# EAGLE design MotorBoard (EAGLE 8.3.2)
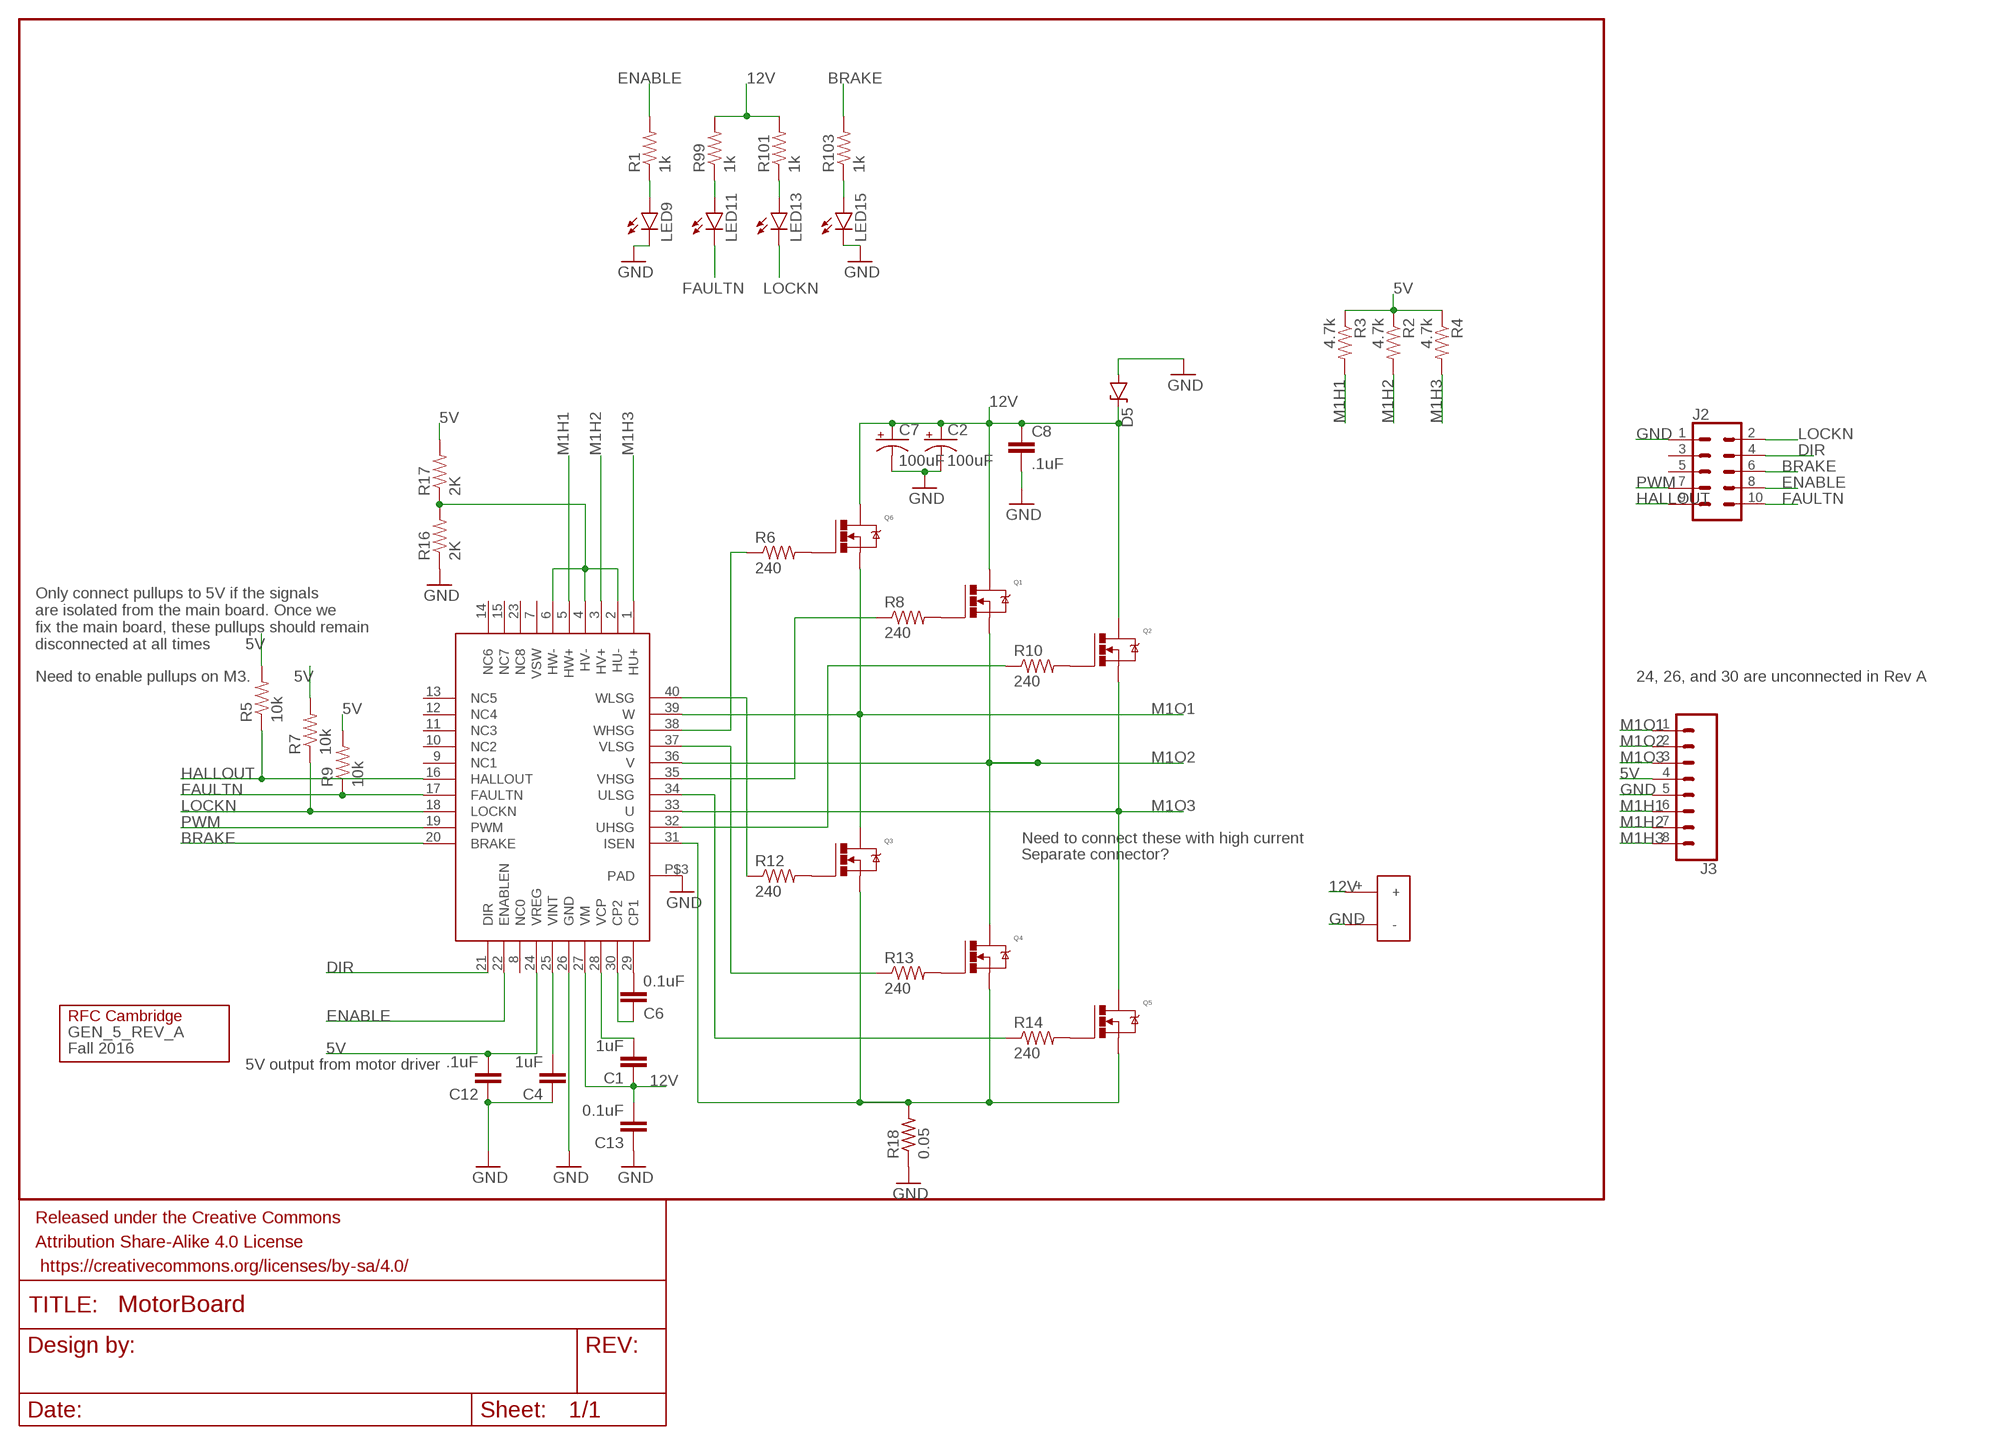
[diagram p0: schematic, sheet 1]

## Parts
C1  1uF  CAP0805  [0805]
C2  100uF  CAP-POLAR  [PANASONIC_D]
C4  1uF  CAP0805  [0805]
C6  0.1uF  CAP0805  [0805]
C7  100uF  CAP-POLAR  [PANASONIC_D]
C8  .1uF  CAP0805  [0805]
C12  .1uF  CAP0805  [0805]
C13  0.1uF  CAP0805  [0805]
D5  DIODE-ZENERDO214AC  [DO214AC]
FRAME7  FRAME-LETTER  [CREATIVE_COMMONS]
GEN_5_REV_A  Fall 2016  LOGO  [LOGO]
J2  CONN_05X2SHD  [2X5-SHROUDED]
J3  CONN_08LONGPADS  [1X08_LONGPADS]
LED9  LED1206  [LED-1206]
LED11  LED1206  [LED-1206]
LED13  LED1206  [LED-1206]
LED15  LED1206  [LED-1206]
Q1  N-MOSFET  [DPAK]
Q2  N-MOSFET  [DPAK]
Q3  N-MOSFET  [DPAK]
Q4  N-MOSFET  [DPAK]
Q5  N-MOSFET  [DPAK]
Q6  N-MOSFET  [DPAK]
R1  1k  RESISTOR0805-RES  [0805]
R2  4.7k  RESISTOR0805-RES  [0805]
R3  4.7k  RESISTOR0805-RES  [0805]
R4  4.7k  RESISTOR0805-RES  [0805]
R5  10k  RESISTOR0805-RES  [0805]
R6  240  RESISTOR0805-RES  [0805]
R7  10k  RESISTOR0805-RES  [0805]
R8  240  RESISTOR0805-RES  [0805]
R9  10k  RESISTOR0805-RES  [0805]
R10  240  RESISTOR0805-RES  [0805]
R12  240  RESISTOR0805-RES  [0805]
R13  240  RESISTOR0805-RES  [0805]
R14  240  RESISTOR0805-RES  [0805]
R16  2K  RESISTOR0805-RES  [0805]
R17  2K  RESISTOR0805-RES  [0805]
R18  0.05  R-US_R2512  [R2512]
R99  1k  RESISTOR0805-RES  [0805]
R101  1k  RESISTOR0805-RES  [0805]
R103  1k  RESISTOR0805-RES  [0805]
U$1  DRV8307  [QFN40-6X6]
U$2  POWER_CONN_2X1  [POWER_CONN_2X1]

## Nets
5V: C12.2 J3.4 R2.1 R3.1 R4.1 R5.2 R7.2 R9.2 R17.2 U$1.24(VREG)
12V: C1.1 C2.+ C7.+ C8.1 C13.2 D5.C Q1.DRAIN Q2.DRAIN Q6.DRAIN R99.2 R101.2 U$1.27(VM) U$2.+
BRAKE: J2.6 R103.2 U$1.20(BRAKE)
DIR: J2.4 U$1.21(DIR)
ENABLE: J2.8 R1.2 U$1.22(ENABLEN)
FAULTN: J2.10 LED11.C R9.1 U$1.17(FAULTN)
GND: C2.- C4.1 C7.- C8.2 C12.1 C13.1 D5.A J2.1 J3.5 LED9.C LED15.C R16.1 R18.1 U$1.26(GND) U$1.P$3(PAD) U$2.-
HALLOUT: J2.9 R5.1 U$1.16(HALLOUT)
LOCKN: J2.2 LED13.C R7.1 U$1.18(LOCKN)
M1H1: J3.6 R3.2 U$1.5(HW+)
M1H2: J3.7 R2.2 U$1.3(HV+)
M1H3: J3.8 R4.2 U$1.1(HU+)
M1O1: J3.1 Q3.DRAIN Q6.SOURCE U$1.39(W)
M1O2: J3.2 Q1.SOURCE Q4.DRAIN U$1.36(V)
M1O3: J3.3 Q2.SOURCE Q5.DRAIN U$1.33(U)
N$1: LED9.A R1.1
N$2: C6.2 U$1.29(CP1)
N$4: C1.2 U$1.28(VCP)
N$6: Q6.GATE R6.2
N$7: Q1.GATE R8.2
N$9: C6.1 U$1.30(CP2)
N$10: Q2.GATE R10.2
N$11: Q3.GATE R12.2
N$13: Q4.GATE R13.2
N$14: Q5.GATE R14.2
N$15: C4.2 U$1.25(VINT)
N$16: R6.1 U$1.38(WHSG)
N$17: R14.1 U$1.34(ULSG)
N$18: R13.1 U$1.37(VLSG)
N$19: R12.1 U$1.40(WLSG)
N$20: R8.1 U$1.35(VHSG)
N$21: R10.1 U$1.32(UHSG)
N$22: R16.2 R17.1 U$1.2(HU-) U$1.4(HV-) U$1.6(HW-)
N$114: LED11.A R99.1
N$117: LED13.A R101.1
N$119: LED15.A R103.1
O1: Q3.SOURCE Q4.SOURCE Q5.SOURCE R18.2 U$1.31(ISEN)
PWM: J2.7 U$1.19(PWM)
Unconnected: J2.3 J2.5 U$1.7(VSW) U$1.8(NC0) U$1.9(NC1) U$1.10(NC2) U$1.11(NC3) U$1.12(NC4) U$1.13(NC5) U$1.14(NC6) U$1.15(NC7) U$1.23(NC8)

## Notes on the sheet
- Only connect pullups to 5V if the signals
  are isolated from the main board. Once we 
  fix the main board, these pullups should remain
  disconnected at all times
- Need to enable pullups on M3. | 24, 26, and 30 are unconnected in Rev A
- Need to connect these with high current
- Separate connector?
- 5V output from motor driver

## Library data of the parts
C1 C4 C6 C8 C12 C13 = SparkFun-Passives:CAP: Capacitor Standard 0603 ceramic capacitor, and 0.1" leaded capacitor.
C2 C7 = gen3:CAP-POLAR: Cap Alum Polarized Digikey: 493-3953-1-ND low impedence, low ceiling cap; PROD_ID: CAP-10547
D5 = gen3:DIODE-ZENER: Zener Diode Production Part - 8199 3.4V Zener Voltage
FRAME7 = SparkFun-Aesthetics:FRAME-LETTER: Schematic Frame Standard 8.5x11 US Letter frame
GEN_5_REV_A = gen3:LOGO
J2 = SparkFun-Connectors:CONN_05X2: Multi connection point. Often used as Generic Header-pin footprint for 0.1 inch spaced/style header connections For AVR SPI programming port, see special device with nice symbol: "AVR_SPI_PROG_5x2.dev" You can populate with any combo of single row headers, but if you'd like an exact match, check these: 2x5 AVR ICSP Male Header <https://www.sparkfun.com/products/778> (PRT-00778) 2x5 Pin Shrouded Header <https://www.sparkfun.com/products/8506> (PRT-08506) On any of the 0.1 inch spaced packages, you can populate with these: Break Away Headers - Straight <https://www.sparkfun.com/products/116> (PRT-00116) Break Away Male Headers - Right Angle <https://www.sparkfun.com/products/553> (PRT-00553) Female Headers <https://www.sparkfun.com/products/115> (PRT-00115) Break Away Headers - Machine Pin <https://www.sparkfun.com/products/117> (PRT-00117) Break Away Female Headers - Swiss Machine Pin <https://www.sparkfun.com/products/743> (PRT-00743) Special note: the shrouded connector mates well with our 5x2 ribbon cables: 2x5 Pin IDC Ribbon Cable <https://www.sparkfun.com/products/8535> (PRT-08535); PROD_ID: CONN-08671; SF_ID: PRT-08506
J3 = SparkFun-Connectors:CONN_08: Multi connection point. Often used as Generic Header-pin footprint for 0.1 inch spaced/style header connections On any of the 0.1 inch spaced packages, you can populate with these: Break Away Headers - Straight <https://www.sparkfun.com/products/116> (PRT-00116) Break Away Male Headers - Right Angle <https://www.sparkfun.com/products/553> (PRT-00553) Female Headers <https://www.sparkfun.com/products/115> (PRT-00115) Break Away Headers - Machine Pin <https://www.sparkfun.com/products/117> (PRT-00117) Break Away Female Headers - Swiss Machine Pin <https://www.sparkfun.com/products/743> (PRT-00743) Arduino Stackable Header - 8 Pin <https://www.sparkfun.com/products/9279> (PRT-09279) For SCREWTERMINALS and SPRING TERMINALS visit here: Screw Terimnals on SparkFun.com <https://www.sparkfun.com/search/results?term=Screw+Terminals> (5mm/3.5mm/2.54mm spacing) This device is also useful as a general connection point to wire up your design to another part of your project. Our various solder wires solder well into these plated through hole pads. Hook-Up Wire - Assortment (Stranded, 22 AWG) <https://www.sparkfun.com/products/11375> (PRT-11375) Hook-Up Wire - Assortment (Solid Core, 22 AWG) <https://www.sparkfun.com/products/11367> (PRT-11367) View the entire wire category on our website here <https://www.sparkfun.com/categories/141> Special notes: Molex polarized connector foot print use with SKU : PRT-08231 with associated crimp pins and housings. 1MM SMD Version SKU: PRT-10208 NOTES ON THE VARIANTS LOCK and LOCK_LONGPADS... This footprint was designed to help hold the alignment of a through-hole component (i.e. 6-pin header) while soldering it into place. You may notice that each hole has been shifted either up or down by 0.005 of an inch from it's more standard position (which is a perfectly straight line). This slight alteration caused the pins (the squares in the middle) to touch the edges of the holes. Because they are alternating, it causes a "brace" to hold the component in place. 0.005 has proven to be the perfect amount of "off-center" position when using our standard breakaway headers. Although looks a little odd when you look at the bare footprint, once you have a header in there, the alteration is very hard to notice. Also,if you push a header all the way into place, it is covered up entirely on the bottom side.
LED9 LED11 LED13 LED15 = SparkFun-LED:LED: LEDs Standard schematic elements and footprints for 5mm, 3mm, 1206, and 0603 sized LEDs. 5mm - Spark Fun Electronics SKU : COM-00529 (and others)
Q1-Q6 = rfc:N-MOSFET: N-Channel Power Mosfet
R1 R99 R101 R103 = SparkFun-Passives:RESISTOR: Resistor Basic schematic elements and footprints for 0603, 1206, and PTH resistors.
R2-R10 R12-R14 R16 R17 = SparkFun-Resistors:RESISTOR: Resistor Basic schematic elements and footprints for 0603, 1206, and PTH resistors.
R18 = resistor:R-US_: RESISTOR, American symbol
U$1 = texas2:DRV8307
U$2 = Kicker:POWER_CONN_2X1

## Board
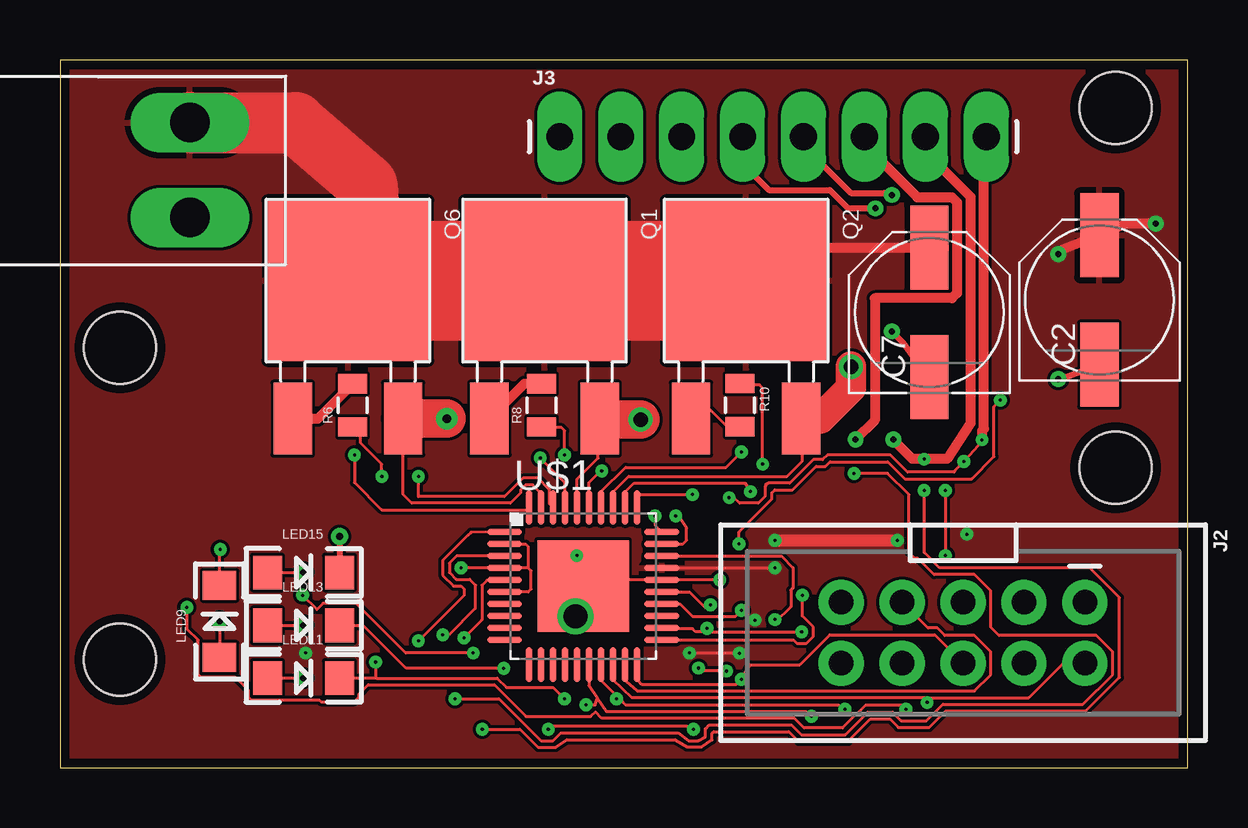
[diagram p1: board, top side]
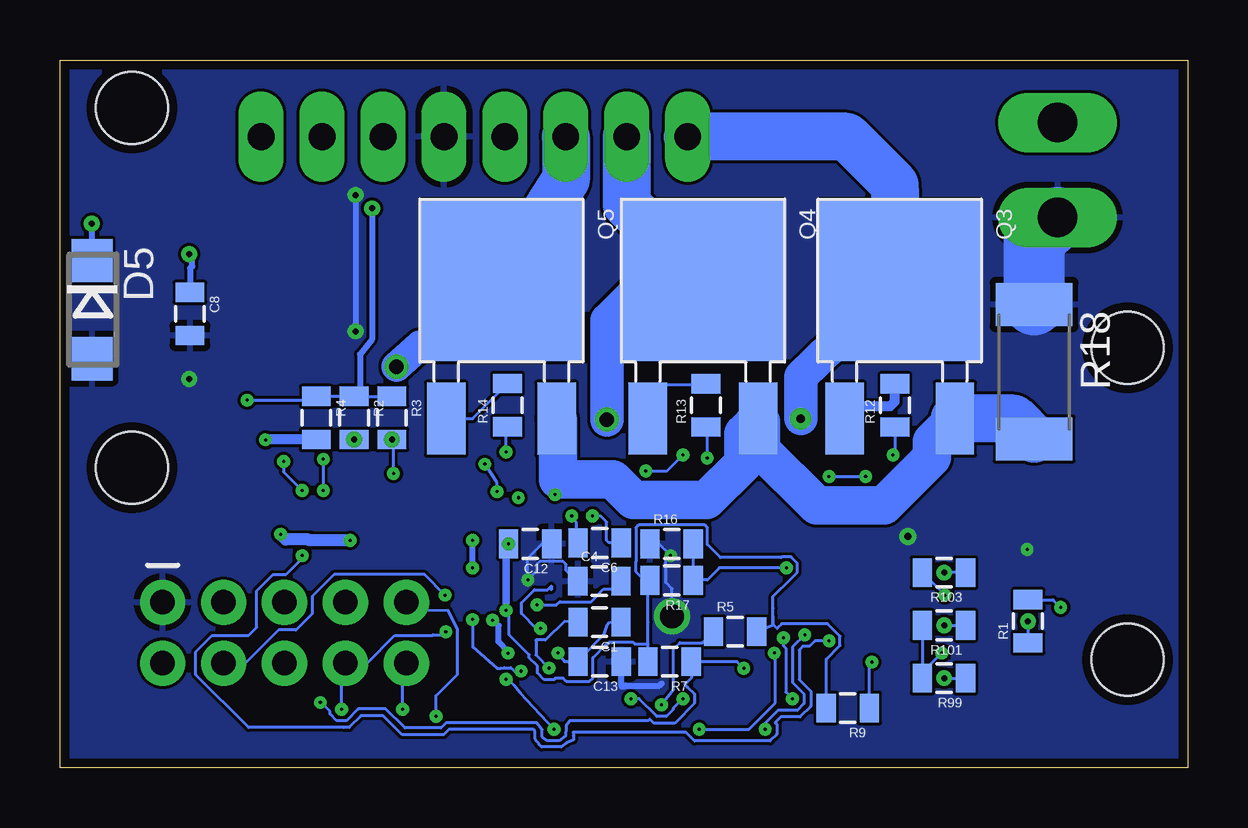
[diagram p2: board, bottom side, seen from below]

Size 47 x 29.5 mm. Coordinates in mm from the lower left corner, seen from the top.
Outline: 0,0 47,0 47,29.5 0,29.5 0,0
Copper layers (1*16): Top 0.035559375mm / dielectric 1.501140625mm / Bottom 0.035559375mm
Design rules "typical_4pcb *": minimum track width 10mil, minimum drill 15mil, track to track 5mil, track to pad 5mil, pad to pad 5mil, via to via 5mil, smd to smd 5mil, copper to edge 15mil, drill to drill 8mil, minimum pad ring 10mil, minimum via ring 8mil, stop-mask expansion 4mil, vias tented up to drill 0mil, thermal gap 10mil
Holes 3 mm at 2.5,4.5 44,12.5 2.5,17.5 44,27.5

### Footprints (pad centres in the part's own frame; a part is rotated, then mirrored left to right if it is on the bottom)
0805 = smd 0.8 x 1.2: 1 -0.9,0; 2 0.9,0
PANASONIC_D = smd 3.5 x 1.6: + 2.7,0; - -2.7,0
DO214AC = smd 1.8 x 1.7: A 2.05,0; C -2.05,0
2X5-SHROUDED = drill 1.016 pad 1.88: 1 -1.27,5.08; 2 1.27,5.08; 3 -1.27,2.54; 4 1.27,2.54; 5 -1.27,0; 6 1.27,0; 7 -1.27,-2.54; 8 1.27,-2.54; 9 -1.27,-5.08; 10 1.27,-5.08
1X08_LONGPADS = drill 1.118 pad 1.88 long: 1 0,0; 2 2.54,0; 3 5.08,0; 4 7.62,0; 5 10.16,0; 6 12.7,0; 7 15.24,0; 8 17.78,0
LED-1206 = smd 1.2 x 1.4: A -1.5,0; C 1.5,0
DPAK = smd 6.7 x 6.7: DRAIN 0,0 | smd 3 x 1.6: GATE 5.75,-2.3; SOURCE 5.75,2.3
R2512 = smd 1.8 x 3.2: 1 -2.8,0; 2 2.8,0
QFN40-6X6 = smd 1.458 x 0.28: 1 -3.279,2.25; 2 -3.279,1.75; 3 -3.279,1.25; 4 -3.279,0.75; 5 -3.279,0.25; 6 -3.279,-0.25; 7 -3.279,-0.75; 8 -3.279,-1.25; 9 -3.279,-1.75; 10 -3.279,-2.25; 21 3.279,-2.25; 22 3.279,-1.75; 23 3.279,-1.25; 24 3.279,-0.75; 25 3.279,-0.25; 26 3.279,0.25; 27 3.279,0.75; 28 3.279,1.25; 29 3.279,1.75; 30 3.279,2.25 | smd 0.28 x 1.458: 11 -2.25,-3.279; 12 -1.75,-3.279; 13 -1.25,-3.279; 14 -0.75,-3.279; 15 -0.25,-3.279; 16 0.25,-3.279; 17 0.75,-3.279; 18 1.25,-3.279; 19 1.75,-3.279; 20 2.25,-3.279; 31 2.25,3.279; 32 1.75,3.279; 33 1.25,3.279; 34 0.75,3.279; 35 0.25,3.279; 36 -0.25,3.279; 37 -0.75,3.279; 38 -1.25,3.279; 39 -1.75,3.279; 40 -2.25,3.279 | smd 3.81 x 3.81: P$3 0,0
POWER_CONN_2X1 = drill 1.65 long: + 0,0; - 0,-3.96

### Placement (x,y rotation side)
C1  24.51,6.06 180 bottom
C2  43.33,19.49 90 top
C4  24.51,7.77 0 bottom
C6  24.51,9.37 180 bottom
C7  36.24,18.97 90 top
C8  41.58,18.91 270 bottom
C12  27.4,9.32 180 bottom
C13  24.51,4.42 180 bottom
D5  45.66,19.09 270 bottom
FRAME7  -91.74,7.44 0 top  (outside the outline)
GEN_5_REV_A  -73.96,-3.99 0 top  (outside the outline)
J2  37.64,5.62 270 top
J3  20.84,26.3 0 top
LED9  6.65,6.1 90 top
LED11  10.15,3.73 0 top
LED13  10.15,5.93 0 top
LED15  10.15,8.13 0 top
Q1  20.2,20.3 270 top
Q2  28.6,20.3 270 top
Q3  12,20.3 270 bottom
Q4  20.2,20.3 270 bottom
Q5  28.6,20.3 270 bottom
Q6  12,20.3 270 top
R1  6.65,6.1 90 bottom
R2  34.74,14.58 270 bottom
R3  33.16,14.58 270 bottom
R4  36.31,14.58 270 bottom
R5  18.86,5.67 0 bottom
R6  12.2,15.1 90 top
R7  21.59,4.42 180 bottom
R8  20.07,15.1 90 top
R9  14.16,2.48 180 bottom
R10  28.34,15.11 270 top
R12  12.2,15.1 90 bottom
R13  20.07,15.1 90 bottom
R14  28.34,15.11 90 bottom
R16  21.5,9.32 0 bottom
R17  21.5,7.8 180 bottom
R18  6.4,16.5 270 bottom
R99  10.15,3.73 180 bottom
R101  10.15,5.93 180 bottom
R103  10.15,8.13 180 bottom
U$1  21.81,7.57 0 top
U$2  5.41,26.89 0 top

### Tracks (layer width: path | path; a pad name or v marks a point on that pad's centre or on a via)
5V  (via drill 0.13, 0.25)
  Top 0.127: U$1.24 25.85,6.82 26.37,6.3 28.15,6.3 28.27,6.42 v28.39,6.56 v28.4,6.55 | C12.2 28.3,9.82 29.67,11.19 29.67,11.45 29.8,11.58 30.54,11.58 31.51,12.55 31.91,12.55 32.1,12.75 34.5,12.75 35.21,12.04 38,12.04 38.93,12.97 38.93,15.05 v39.2,15.31
  Top 0.254: J3.4 28.45,25.17 29.55,24.08 32.09,24.08 32.85,23.31 v33.99,23.31
  Bottom 0.127: R3.1 R2.1 R4.1 36.48,15.31 v39.2,15.31 | 28.32,9.31 C12.2 | 22.4,7.59 22.49,7.42 22.49,6.07 22.49,5.15 | 22.4,7.59 R17.2 | R7.2 22.49,5.15 | 22.49,5.15 23.04,5.15 23.12,5.23 24.1,5.23 24.17,5.15 24.21,5.15 24.79,4.57 24.79,3.73 24.92,3.6 25.9,3.6 26.02,3.73 26.35,3.73 26.42,3.66 26.82,3.66 27.1,3.95 27.1,4.23 27.45,4.58 27.45,4.71 28.27,5.54 28.27,6.42 v28.4,6.55 | R9.2 15.06,4.51 14.48,5.09 14.48,5.47 15,5.99 16.91,5.99 17.11,5.8 17.27,5.96 17.27,6.31 | 17.27,6.31 17.27,6.64 17.28,7.14 16.53,7.87 16.26,8.14 16.26,8.52 16.53,8.79 16.91,8.79 16.94,8.76 19.47,8.76 20.01,9.29 20.01,10 20.12,10.11 22.88,10.11 22.99,10 22.99,8.59 23,8.58 23,8.19 22.4,7.59 | R5.2 17.27,5.95 17.27,6.31
  Bottom 0.254: v33.99,23.31 33.99,17.85 34.5,17.22 34.5,15.47 R2.1
  Bottom 0.305: v28.4,6.55 28.4,9.22 28.32,9.31
  other vias: 28.3,9.32
12V  (via drill 0.13, 0.25)
  Top 0.127: v26.24,4.77 v28.31,4.77 v28.32,4.77 | U$1.27 29.78,8.32 v29.8,8.33 | 32.82,9.47 v29.8,9.47
  Top 0.406: C7.+ 29.97,21.67 Q2.DRAIN | v45.67,22.68 44.46,22.68 C2.+ 41.78,21.58 v41.61,21.41
  Top 0.508: v29.8,9.47 v34.9,9.47 34.92,9.47
  Top 2.54: U$2.+ 9.81,26.89 12.8,24.3 13,20.5 Q6.DRAIN
  Top 5: Q6.DRAIN Q1.DRAIN Q2.DRAIN
  Bottom 0.127: C1.1 24.08,6.04 24.21,5.92 24.34,5.54 25.35,4.52 C13.2 25.97,4.42 v26.24,4.77 | R101.2 R99.2 11.05,3.96 v10.24,4.77 | 28.94,6.13 28.94,6.17 v28.97,6.14
  Bottom 0.254: C8.1 41.58,20.8 41.48,20.9 41.48,21.28 v41.61,21.41 | D5.C 45.66,22.66 v45.67,22.68 | v28.32,4.77 28.32,4.83 28.72,5.24 28.72,5.92 28.94,6.13 | v29.8,8.33 v29.8,9.47
  Bottom 0.508: v34.9,9.47 36.59,9.47 36.63,9.51 37.58,9.51 v37.8,9.73
  pour Top: -1.74,0.27 -1.66,29.28 47.96,29.28 48.2,0.27
BRAKE  (via drill 0.13)
  Top 0.127: J2.6 36.46,5.54 32.09,5.54 30.84,4.29 28.76,4.29 v28.4,3.68 28.2,3.47 24.24,3.47 24.08,3.63 24.08,4.26 U$1.20 | v26.41,1.59 26.4,1.57 26.12,1.73 20.4,1.73 v20.35,1.6 | v17.23,4.77 14.41,4.77 12.34,6.84 10.96,6.84 10.71,6.59 v10.11,7.19
  Bottom 0.127: v28.4,3.68 28.32,3.68 28.07,3.42 27.81,3.12 v26.41,1.59 | v10.11,7.19 R103.2 | v20.35,1.6 18.28,1.6 17.18,2.7 17.18,4.73 v17.23,4.77
DIR  (via drill 0.13)
  Top 0.127: U$1.21 30.58,5.32 30.72,5.18 31.12,5.18 31.4,5.46 31.4,5.86 30.94,6.32 v30.94,7.19
  Bottom 0.127: J2.4 39.28,4.35 37.89,5.73 37.17,5.73 36.49,6.41 36.49,7.14 35.58,8.05 31.8,8.05 v30.94,7.19
ENABLE  (via drill 0.13)
  Top 0.127: 26.88,5.66 v30.92,5.66 | 26.88,5.66 26.5,5.66 26.37,5.79 25.11,5.79 U$1.22 | v26.97,5.8 26.97,5.75 26.88,5.66 | v5.29,6.68 5.29,5.79 5.76,5.31 5.73,5.29 5.73,3.91 5.86,3.78 7.3,3.78 7.84,3.24 7.84,2.94 7.96,2.81 10.8,2.81 10.88,2.74 12.27,2.74 12.47,2.94 12.47,3.06 12.85,3.45 18.11,3.45 19.42,2.13 22.12,2.13 22.31,2.32 22.58,2.05 30.61,2.05 31.02,1.65 32.62,1.65 33.58,2.61 35.13,2.61 35.26,2.49 v35.26,2.43
  Bottom 0.127: v30.92,5.66 30.94,5.66 31.07,5.54 31.45,5.54 31.48,5.51 33.04,5.51 34.2,4.35 J2.8 35.26,4.2 v35.26,2.43 | 26.52,7.42 26.52,7.57 26.67,7.41 27.23,7.41 27.77,6.87 27.77,6.42 27.13,5.79 27.01,5.76 v26.97,5.8 | R1.2 5.61,7 v5.29,6.68
FAULTN  (via drill 0.13)
  Top 0.127: U$1.17 22.56,3.63 23.45,2.74 | v32.72,2.43 32.72,2.36 32.47,2.61 23.58,2.61 23.45,2.74 | 13.2,3.73 LED11.C | 13.2,3.73 18.22,3.73 18.61,3.34 20.56,3.34 v21.04,2.86 v21.04,2.87 | 23.45,2.74 23.32,2.74 v23.2,2.87 | v13.16,4.39 13.16,3.77 13.2,3.73
  Bottom 0.127: J2.10 32.72,4.2 v32.72,2.43 | 23.32,2.87 v23.2,2.87 22.86,2.87 22.12,2.13 21.73,2.13 21.44,2.41 21.44,2.46 v21.04,2.87 | R9.1 13.26,4.28 13.18,4.36 v13.16,4.39
GND  (via drill 0.13, 0.25, 0.3, 1)
  Top 0.127: v27.5,7.82 U$1.26 22.06,7.82 | 22.06,7.82 U$1.P$3 | LED9.C 6.65,9.06 v6.68,9.09 | 22.06,7.82 22.06,8.32 21.81,8.07 U$1.P$3 | U$1.P$3 21.81,8.57 v21.54,8.84
  Top 0.254: J3.5 30.99,25.93 32.97,23.95 34.35,23.95 v34.68,23.88 | v34.68,18.18 35.13,17.73 36.05,16.46 C7.- | C2.- 41.63,16.18 v41.61,16.2 | LED15.C v11.65,9.63 v11.66,9.64
  Bottom 0.127: 26.46,9.37 C12.1 26.9,9.32 27.51,8.71 27.51,7.82 | v27.5,7.82 27.51,7.82 | R16.1 22.03,9.32 v21.54,8.84 21.75,8.63 21.75,7.71 21.49,7.45 v21.49,6.3 | C4.1 25.9,8.21 25.9,8.46 26.03,8.59 27.01,8.59 27.13,8.46 27.13,8.2 27.51,7.82
  Bottom 0.254: v34.68,23.88 v34.68,18.18 | C13.1 23.61,3.41 23.58,3.38 23.46,3.38 23.42,3.41 22.01,3.41 21.92,3.5
  Bottom 2.54: R18.1 6.4,21.94 U$2.-
  pour Bottom: -1.66,29.28 -1.68,0.26 48.13,0.26 47.96,29.28
HALLOUT  (via drill 0.13)
  Top 0.127: U$1.16 22.07,4.14 22.05,3.41 22.4,2.88 | 22.4,2.88 22.78,2.34 31.09,2.34 31.32,2.11 v31.32,2.13 | v21.92,2.61 22.31,2.61 22.4,2.88
  Bottom 0.127: J2.9 32.47,6.54 30.81,6.55 30.43,5.79 30.43,3.88 31.32,3 v31.32,2.13 | v21.92,2.61 21.42,3.25 21.42,5.03 21.34,5.03 21.16,5.21 20.22,5.21 R5.1
LOCKN  (via drill 0.13)
  Top 0.127: J2.2 41.82,4.35 40.38,2.92 36.16,2.92 | U$1.18 23.06,4.24 23.06,3.65 23.84,2.92 36.16,2.92 | v18.5,4.14 14.43,4.14 12.65,5.92 11.66,5.92 LED13.C | v36.15,2.71 36.15,2.91 36.16,2.92
  Bottom 0.127: v18.5,4.14 18.77,4.42 R7.1 20.69,3.74 20.95,3.47 20.84,3.35 20.55,3.07 20.55,2.67 21.37,1.85 22.24,1.85 22.41,2.02 22.48,1.95 25.74,1.95 25.9,1.75 25.9,1.68 25.94,1.32 26.2,1.12 26.68,1.12 26.89,1.27 26.9,1.27 26.9,1.58 27.13,1.87 30.9,1.87 31.12,1.65 32.62,1.65 33.42,2.45 34.56,2.45 35.06,1.95 35.46,1.95 35.74,2.23 35.74,2.34 36.15,2.75 v36.15,2.72 v36.15,2.71
M1H1  (via drill 0.13, 0.25)
  Top 0.127: v16.84,5.41 17.59,6.16 17.59,6.17 17.59,7.6 17.79,7.81 U$1.5 | v16.46,2.87 18.29,2.87 20.05,1.11 20.55,1.11 20.88,1.45 25.76,1.45 26.2,1.12 26.6,1.12 26.9,1.27 26.9,1.62 27.06,1.78 30.5,1.78 30.9,1.37 32.73,1.37 33.67,2.3 34.71,2.3 35.06,1.95 36.12,1.95 36.81,2.64 42.64,2.64 43.88,3.87 43.88,4.83 43.2,5.51 39.14,5.51 38.8,5.85 38.8,7.37 38.12,8.05 36.43,8.05 35.77,8.71 35.64,8.71 35.39,8.96 35.39,11.38 34.5,12.27 v33.1,12.27
  Top 0.406: J3.6 33.53,25.98 35.74,23.78 37.19,23.78 37.39,23.57 37.39,19.78 37.19,19.57 33.97,19.57 33.97,14.48 R3.2
  Bottom 0.127: v16.84,5.41 16.84,5.07 16.74,4.97 16.74,3.15 v16.46,2.87 | v33.1,12.27 33.1,13.61 R3.2
  other vias: 33.16,13.68
M1H2  (via drill 0.13, 0.25)
  Top 0.127: U$1.3 16.52,8.82 16.23,8.53 16.23,8.13 16.52,7.85 17.07,7.85 17.32,7.6 17.3,7.58 17.3,6.63 16.21,5.54 v15.96,5.54 | v17.6,1.59 19.17,1.59 19.93,0.84 20.67,0.84 21.13,1.17 25.65,1.17 26.13,0.86 26.76,0.86 27.18,1.16 27.18,1.42 27.26,1.5 30.38,1.5 30.79,1.09 32.85,1.09 33.78,2.02 34.59,2.02 34.94,1.67 36.24,1.67 36.92,2.36 42.76,2.36 44.16,3.76 44.16,7.09 42.92,8.33 36.66,8.33 36.02,8.96 v36.02,11.56 36.02,11.63 | 35.52,12.87 v36.01,12.87 v36.02,12.86
  Top 0.406: J3.7 36.08,25.68 37.95,23.8 37.95,14.35 36.98,12.87 35.52,12.87 34.84,13.55 R2.2
  Bottom 0.127: v15.96,5.54 16.46,5.03 16.46,3.55 15.98,3.07 15.98,2.67 16.26,2.39 17.07,2.39 17.73,1.73 v17.6,1.59 | v36.02,12.86 v36.02,11.56
  other vias: 34.74,13.68
M1H3  (via drill 0.13)
  Top 0.127: v38.44,13.66 38.5,13.66 v37.68,12.77 37.32,12.4 37.32,12.37 37.28,12.32 35.33,12.32 34.62,13.03 31.98,13.03 31.79,12.83 31.4,12.83 30.42,11.86 29.55,11.86 29.42,11.81 29.39,11.7 29.39,11.3 29.11,11.02 28.33,11.02 28.1,11.25 v27.89,11.25 | U$1.1 17.13,9.81 16.98,9.67 15.96,8.64 15.96,8.01 16.4,7.57 16.72,7.57 16.84,7.44 16.84,7.19 v14.94,5.28 | v36.91,8.84 v36.91,11.56 36.91,11.63
  Top 0.406: v38.44,13.66 38.44,14.04 38.51,14.12 38.51,26.2 J3.8
  Bottom 0.127: v27.89,11.25 27.94,11.25 | v14.94,5.28 15.53,5.28 15.76,5.05 16.03,5.05 16.18,4.9 16.18,3.67 15.7,3.18 15.7,2.55 16.15,2.11 16.96,2.11 17.2,1.87 17.12,1.79 17.12,1.39 17.4,1.11 20.55,1.11 20.91,1.47 25.6,1.47 25.6,1.34 25.6,1.14 25.6,1.15 25.62,1.14 25.89,1.02 26.11,0.86 26.92,0.86 27.04,0.97 27.04,1 27.14,1.09 27.19,1.17 27.2,1.21 27.2,1.51 27.26,1.59 30.79,1.59 31.01,1.37 32.74,1.37 33.54,2.17 34.45,2.17 34.94,1.67 35.18,1.67 | 35.18,1.67 | 35.18,1.67 39.14,1.67 41.34,3.87 41.34,4.83 40.66,5.51 39.14,5.51 38.8,5.85 38.8,7.37 38.12,8.05 37.58,8.05 36.91,8.71 v36.91,8.84 | v37.68,12.77 37.68,12.33 v36.91,11.56
  Bottom 0.406: R4.2 38.42,13.68 v38.44,13.66
M1O1  (via drill 0.35 pad 0.9)
  Top 0.127: 16.56,14.12 v16.12,14.55 | U$1.39 20.06,11.44 19.71,11.79 19.41,11.79 19.2,11.58 19.2,11.45 18.77,11.02 14.66,11.02 14.3,11.38 Q6.SOURCE
  Top 1.6: Q6.SOURCE v16.12,14.55
  Bottom 1.4: v16.12,14.55 16.12,16.3 Q3.DRAIN
  Bottom 2: Q3.DRAIN 12.2,24.3 14.2,26.3 J3.1
M1O2  (via drill 0.6)
  Top 0.127: U$1.36 21.56,12.03 22.43,12.9 22.43,14.48 Q1.SOURCE
  Top 1.6: Q1.SOURCE 22.7,14.51 v24.2,14.51
  Bottom 1.4: v24.2,14.51 v24.2,14.5 24.2,18.66 22.6,20.26 20.24,20.26 Q4.DRAIN
  Bottom 2: Q4.DRAIN 23.38,23.48 J3.2
M1O3  (via drill 0.6)
  Top 0.127: U$1.33 23.06,11.5 23.7,12.14 30.31,12.14 30.94,12.77 30.94,14.51 Q2.SOURCE
  Top 1.27: Q2.SOURCE 31.7,14.55 32.97,15.82 v32.97,16.71
  Bottom 1.27: v32.97,16.71 31.98,17.6 31.66,17.68 31.6,17.68 Q5.DRAIN
  Bottom 2: J3.3 25.91,24.51 Q5.DRAIN
N$1  (via drill 0.25)
  Top 0.127: v6.65,6.09 LED9.A
  Bottom 0.127: v6.65,6.09 R1.1
N$2  (via drill 0.13)
  Top 0.127: U$1.29 25.96,9.32 26.12,9.47 26.12,9.98 25.86,10.36 25.79,10.36 v25.67,10.49
  Bottom 0.127: v25.67,10.49 25.74,10.49 25.48,10.23 25.48,9.44 C6.2
N$4  (via drill 0.13)
  Top 0.127: v29.8,6.17 29.8,6.04 30.46,6.7 30.46,7.39 30.56,7.49 30.56,8.33 30.08,8.82 U$1.28 | v27.78,4.02 26.74,4.02 v26.62,4.14
  Bottom 0.127: C1.2 25.96,6.08 26.77,5.32 27.17,5.32 27.17,4.69 v26.62,4.14 26.49,4.02 | v29.8,6.17 29.8,5.03 28.78,4.14 28.62,4.14 28.48,4.16 28.2,4.16 27.92,3.88 v27.78,4.02
N$6
  Top 0.406: Q6.GATE 10.75,14.55 R6.2
N$7
  Top 0.406: R8.2 19.35,16 Q1.GATE
N$9  (via drill 0.13)
  Top 0.127: v24.81,10.49 24.81,10.1 U$1.30
  Bottom 0.127: C6.1 24.11,9.37 24.21,9.47 24.21,10.23 24.47,10.49 24.93,10.49 v24.81,10.49
N$10
  Top 0.127: R10.2 27.81,14.2 26.92,15.1 | 26.92,15.1 26.69,15.33 | Q2.GATE 26.37,14.55 26.92,15.1
  Top 0.406: 26.69,15.33 26.69,15.39
N$11
  Bottom 0.406: R12.2 12.2,15.26 12.4,15.06 13.79,15.06 Q3.GATE
N$13
  Bottom 0.127: R13.2 20.2,15.95 22.5,15.95 Q4.GATE
N$14
  Bottom 0.127: Q5.GATE 29.8,14.55 R14.2
N$15  (via drill 0.13)
  Top 0.127: U$1.25 26.24,7.32 26.88,6.68 27.01,6.68 v27.11,6.78
  Bottom 0.127: v27.11,6.78 26.31,6.79 26.15,6.91 24.85,6.91 24.74,7.04 24.34,7.44 23.89,7.44 C4.2
N$16  (via drill 0.13)
  Top 0.127: U$1.38 20.41,10.99 20.41,11.58 19.93,12.07 19.3,12.07 18.53,11.3 14.94,11.3 v14.94,12.14 | v13.42,12.14 13.42,12.65 12.53,13.54 12.53,13.87 R6.1
  Bottom 0.127: v14.94,12.14 v13.42,12.14
N$17  (via drill 0.13)
  Top 0.127: U$1.34 22.56,11.5 23.58,12.52 27.77,12.52 v28.4,13.16
  Bottom 0.127: v28.4,13.16 28.4,14.15 R14.1
N$18  (via drill 0.13)
  Top 0.127: U$1.37 21.06,11.86 v20.02,12.9
  Bottom 0.127: v20.02,12.9 20.02,14.15 R13.1
N$19  (via drill 0.13)
  Top 0.127: v12.27,13.03 12.27,11.88 13.42,10.74 19.46,10.74 U$1.40
  Bottom 0.127: R12.1 12.2,13.1 v12.27,13.03
N$20  (via drill 0.13)
  Top 0.127: U$1.35 22.06,11.89 22.56,12.39 v22.58,12.37 | v21.04,13.03 21.04,14.04 20.91,14.17 20.1,14.17 R8.1
  Bottom 0.127: v22.58,12.37 21.7,12.37 v21.04,13.03
N$21  (via drill 0.13)
  Top 0.127: U$1.32 23.56,11.49 23.93,11.86 28.55,11.86 v28.78,11.5 | v29.29,12.65 29.29,15.82 29.16,15.95 28.4,15.95 R10.1
  Bottom 0.127: v28.78,11.5 28.78,11.88 v29.29,12.65
N$22  (via drill 0.13)
  Top 0.127: U$1.6 19.51,7.32 19.64,7.44 19.64,8.2 19.51,8.33 | 19.51,8.33 18.54,8.33 U$1.4 16.73,8.32 v16.72,8.33 | U$1.2 19.41,9.32 19.51,9.22 19.51,8.33
  Bottom 0.127: v16.72,8.33 19.51,8.33 20.02,7.82 20.58,7.82 R17.1 R16.2
N$114  (via drill 0.25)
  Top 0.127: v10.14,3.73 LED11.A
  Bottom 0.127: R99.1 v10.14,3.73 v10.15,3.73
N$117  (via drill 0.25)
  Top 0.127: LED13.A v10.14,5.93 v10.15,5.93
  Bottom 0.127: v10.14,5.93 R101.1
N$119  (via drill 0.25)
  Top 0.127: LED15.A v10.14,8.13
  Bottom 0.127: R103.1 v10.14,8.13 v10.15,8.13
O1  (via drill 0.13)
  Top 0.127: U$1.31 24.06,11.23 24.21,11.38 v26.37,11.38
  Bottom 0.127: 26.37,11.5 v26.37,11.38 | 26.37,11.5 26.37,11.88 26.24,12.01 | Q5.SOURCE 26.3,11.57 26.37,11.5
  Bottom 1.6: Q3.SOURCE 10.65,13.6 10.65,12.93 12.66,10.92 15.45,10.92 17.77,13.25 17.77,14.42 Q4.SOURCE 18.52,13.93 18.52,12.68 20.05,11.15 23.09,11.15 23.95,12.01 26.24,12.01 26.24,14.49 Q5.SOURCE
  Bottom 2: Q3.SOURCE 7.25,14.55 R18.2
PWM
  Top 0.127: U$1.19 23.59,4.19 23.59,3.6 24.06,3.2 38.12,3.2 38.8,3.87 38.8,4.83 38.12,5.51 36.88,5.51 36.58,5.81 36.18,5.81 J2.7